# Altium schematic sheet Sheet1.SchDoc
size A
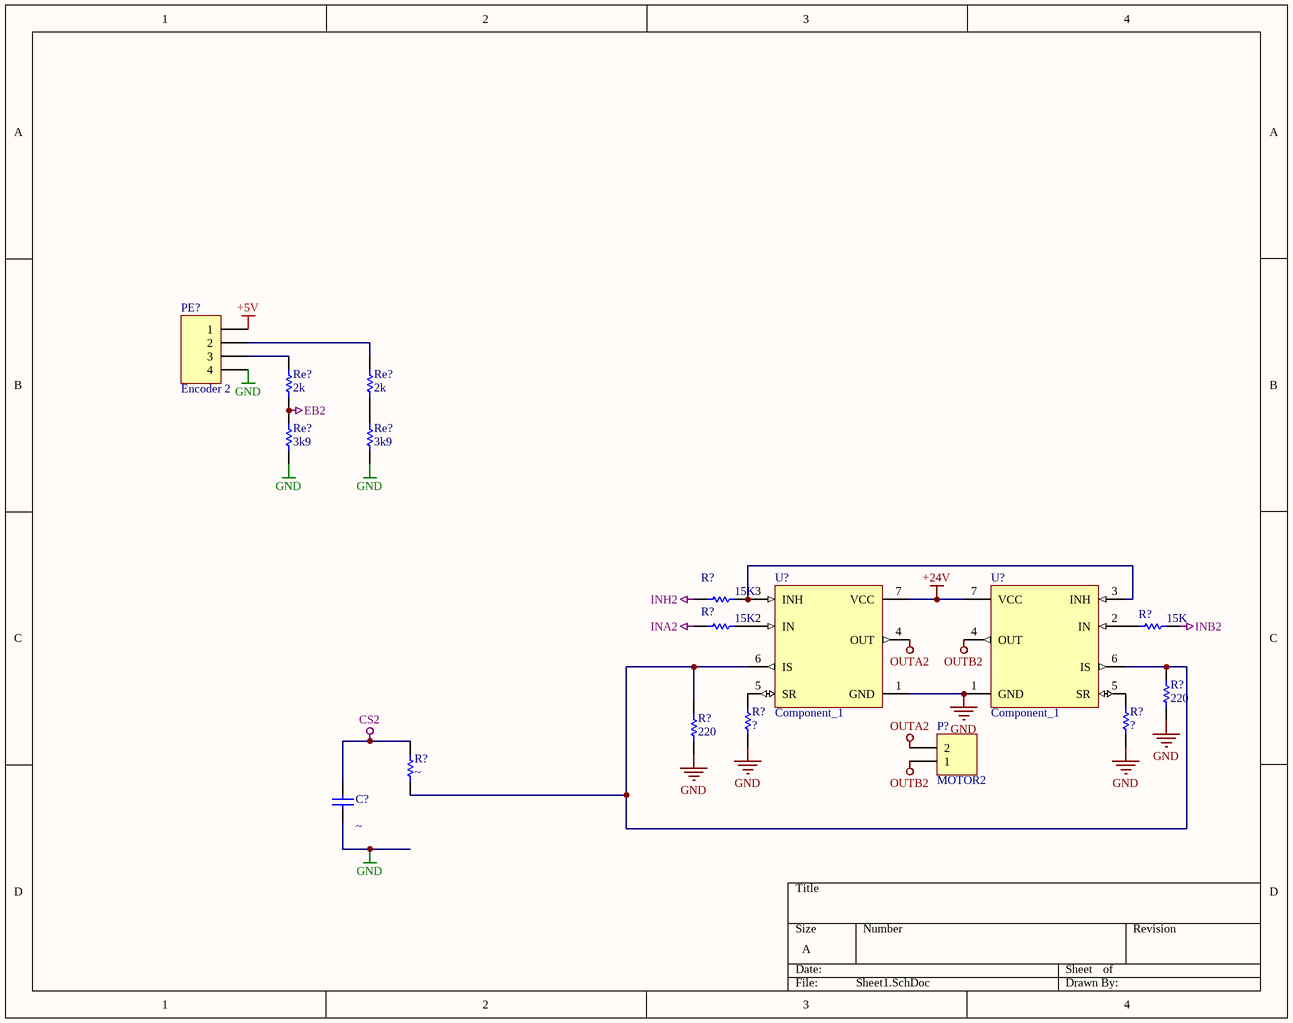
[diagram p0: Sheet1.SchDoc]

## Parts
(Parts that share a designator on the sheet are numbered #1, #2 ... from top to bottom, then left to right.)
C?  value ~  [1206]  (hidden comment: Cap)
P?  MOTOR2  [kombinacija]
PE?  Encoder 2  [BRXCON_4]
R?#1  value 15K  [1206]  (hidden comment: res)
R?#2  value 15K  [1206]  (hidden comment: res)
R?#3  value 15K  [1206]  (hidden comment: res)
R?#4  value 220  [1206]  (hidden comment: res)
R?#5  res  [1206]  (value not drawn)
R?#6  res  [1206]  (value not drawn)
R?#7  value 220  [1206]  (hidden comment: res)
R?#8  value ~  [1206]  (hidden comment: res)
Re?#1  value 2k  [1206]  (hidden comment: res)
Re?#2  value 2k  [1206]  (hidden comment: res)
Re?#3  value 3k9  [1206]  (hidden comment: res)
Re?#4  value 3k9  [1206]  (hidden comment: res)
U?#1  Component_1  [to263-7]
U?#2  Component_1  [to263-7]

## Nets
+5V: PE?.1
+24V: U?#1.7(VCC) U?#2.7(VCC)
CS2: C?.2 R?#8.1
EB2: Re?#1.2 Re?#3.1
GND: C?.1 PE?.4 R?#4.2 R?#5.2 R?#6.2 R?#7.2 Re?#3.2 Re?#4.2 U?#1.1(GND) U?#2.1(GND)
INA2: R?#2.2
INB2: R?#3.1
INH2: R?#1.2
OUTA2: P?.2 U?#1.4(OUT)
OUTB2: P?.1 U?#2.4(OUT)
NetPE?_2: PE?.2 Re?#2.1
NetPE?_3: PE?.3 Re?#1.1
NetR?#1_1: R?#1.1 U?#1.3(INH) U?#2.3(INH)
NetR?#2_1: R?#2.1 U?#1.2(IN)
NetR?#3_2: R?#3.2 U?#2.2(IN)
NetR?#4_1: R?#4.1 R?#7.1 R?#8.2 U?#1.6(IS) U?#2.6(IS)
NetR?#5_1: R?#5.1 U?#1.5(SR)
NetR?#6_1: R?#6.1 U?#2.5(SR)
NetRe?#2_2: Re?#2.2 Re?#4.1

## Library data of the parts
C? = Cap: Capacitor; Published: 8-Jun-2000; LatestRevisionDate: 17-Jul-2002; LatestRevisionNote: Re-released for DXP Platform.; PackageReference: RAD-0.3; Publisher: Altium Limited
P? = Header 2: Header, 2-Pin; LatestRevisionDate: 17-Jul-2002; LatestRevisionNote: Re-released for DXP Platform.; Publisher: Altium Limited
PE? = Header 4: Header, 4-Pin; LatestRevisionDate: 17-Jul-2002; LatestRevisionNote: Re-released for DXP Platform.; Publisher: Altium Limited
R?#1-R?#8 Re?#1-Re?#4 = Res1: Resistor; Published: 8-Jun-2000; LatestRevisionDate: 17-Jul-2002; LatestRevisionNote: Re-released for DXP Platform.; PackageReference: AXIAL-0.3; Publisher: Altium Limited
  R?#5 R?#6: Value: ?
U?#1 U?#2 = Component_1: btn7960